# EAGLE schematic TESTOMATIC-v2_2 (EAGLE 9.7.0)

## Sheet 1 of 4: External Connections
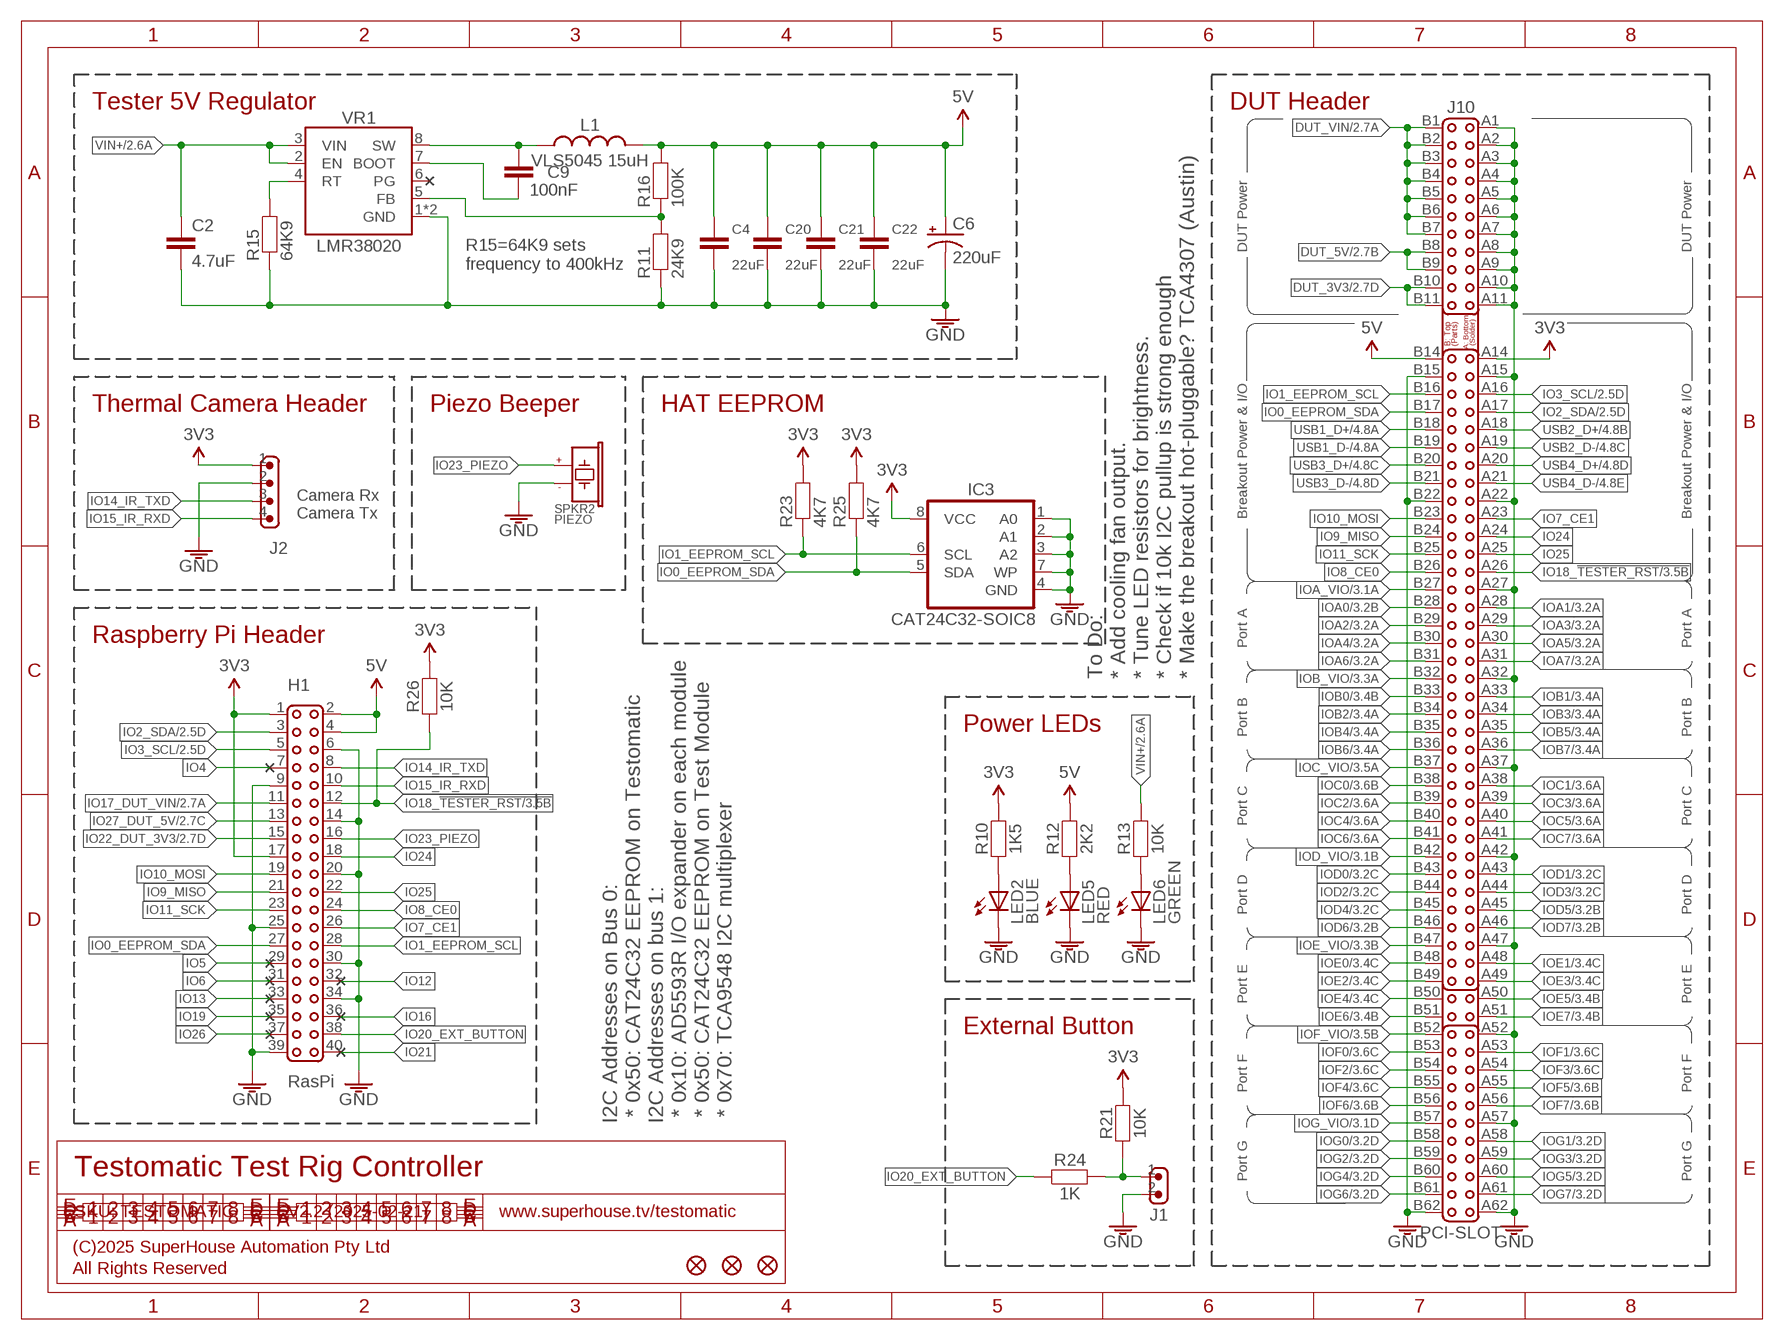
[diagram p0: schematic, sheet 1]

### Parts
C2  4.7uF  CAP1206  [C1206]
C4  22uF  CAP0805  [C0805]
C6  220uF  CAP_POLG  [PANASONIC_G]
C9  100nF  CAP0603  [C0603]
C20  22uF  CAP0805  [C0805]
C21  22uF  CAP0805  [C0805]
C22  22uF  CAP0805  [C0805]
FID1  FIDUCIAL1X2.5  [FIDUCIAL-1X2.5]
FID2  FIDUCIAL1X2.5  [FIDUCIAL-1X2.5]
FID3  FIDUCIAL1X2.5  [FIDUCIAL-1X2.5]
H1  RasPi  M02X20-PIN  [2X20-P]
IC3  CAT24C32-SOIC8  [SOIC8]
J1  M02-B2B-XH  [JST-B2B-XH-A]
J2  M04-B4B-XH  [JST-B4B-XH-A]
J10  PCI-SLOT  [PCI-SLOT]
L1  VLS5045 15uH  INDUCTOR-5045  [INDUCTOR-5045]
LED2  BLUE  LED0603  [LED-0603]
LED5  RED  LED0603  [LED-0603]
LED6  GREEN  LED0603  [LED-0603]
R10  1K5  RESISTOR0603  [R0603]
R11  24K9  RESISTOR0603  [R0603]
R12  2K2  RESISTOR0603  [R0603]
R13  10K  RESISTOR0603  [R0603]
R15  64K9  RESISTOR0603  [R0603]
R16  100K  RESISTOR0603  [R0603]
R21  10K  RESISTOR0603  [R0603]
R23  4K7  RESISTOR0603  [R0603]
R24  1K  RESISTOR0603  [R0603]
R25  4K7  RESISTOR0603  [R0603]
R26  10K  RESISTOR0603  [R0603]
SPKR2  PIEZO  PIEZOPOLARISED-SMT  [PIEZO-9.6X9.6-SMT]
VR1  LMR38020  LMR38010  [HSOIC8]

### Nets
3.3V: H1.1 H1.17 IC3.8(VCC) J2.1 J10.A14 R10.2 R21.2 R23.2 R25.2 R26.2 ; also sheet 2,3,4
5V: C4.1 C6.+ C20.1 C21.1 C22.1 H1.2 H1.4 J10.B14 L1.2 R12.2 R16.2 ; also sheet 2
DUT_3V3: J10.B10 J10.B11 ; also sheet 2
DUT_5V: J10.B8 J10.B9 ; also sheet 2
DUT_VIN: J10.B1 J10.B2 J10.B3 J10.B4 J10.B5 J10.B6 J10.B7 ; also sheet 2
GND: C2.2 C4.2 C6.- C20.2 C21.2 C22.2 H1.6 H1.9 H1.14 H1.20 H1.25 H1.30 H1.34 H1.39 IC3.1(A0) IC3.2(A1) IC3.3(A2) IC3.4(GND) IC3.7(WP) J1.2 J2.2 J10.A1 J10.A2 J10.A3 J10.A4 J10.A5 J10.A6 J10.A7 J10.A8 J10.A9 J10.A10 J10.A11 J10.A15 J10.A22 J10.A27 J10.A32 J10.A37 J10.A42 J10.A47 J10.A52 J10.A57 J10.A62 J10.B15 J10.B22 J10.B62 LED2.C LED5.C LED6.C R11.1 R15.1 SPKR2.2(-) VR1.1(GND) VR1.TGND(GND) ; also sheet 2,3,4
IO0_EEPROM_SDA: H1.27 IC3.5(SDA) J10.B17 R25.1
IO1_EEPROM_SCL: H1.28 IC3.6(SCL) J10.B16 R23.1
IO2_SDA: H1.3 J10.A17 ; also sheet 2,3
IO3_SCL: H1.5 J10.A16 ; also sheet 2,3
IO4: H1.7
IO5: H1.29
IO6: H1.31
IO7_CE1: H1.26 J10.A23
IO8_CE0: H1.24 J10.B26
IO9_MISO: H1.21 J10.B24
IO10_MOSI: H1.19 J10.B23
IO11_SCK: H1.23 J10.B25
IO12: H1.32
IO13: H1.33
IO14_IR_TXD: H1.8 J2.3
IO15_IR_RXD: H1.10 J2.4
IO16: H1.36
IO17_DUT_VIN: H1.11 ; also sheet 2
IO18_!TESTER_RST: H1.12 J10.A26 R26.1 ; also sheet 3
IO19: H1.35
IO20_EXT_BUTTON: H1.38 R24.1
IO21: H1.40
IO22_DUT_3V3: H1.15 ; also sheet 2
IO23_PIEZO: H1.16 SPKR2.1(+)
IO24: H1.18 J10.A24
IO25: H1.22 J10.A25
IO26: H1.37
IO27_DUT_5V: H1.13 ; also sheet 2
IOA0: J10.B28 ; also sheet 3
IOA1: J10.A28 ; also sheet 3
IOA2: J10.B29 ; also sheet 3
IOA3: J10.A29 ; also sheet 3
IOA4: J10.B30 ; also sheet 3
IOA5: J10.A30 ; also sheet 3
IOA6: J10.B31 ; also sheet 3
IOA7: J10.A31 ; also sheet 3
IOA_VIO: J10.B27 ; also sheet 3
IOB0: J10.B33 ; also sheet 3
IOB1: J10.A33 ; also sheet 3
IOB2: J10.B34 ; also sheet 3
IOB3: J10.A34 ; also sheet 3
IOB4: J10.B35 ; also sheet 3
IOB5: J10.A35 ; also sheet 3
IOB6: J10.B36 ; also sheet 3
IOB7: J10.A36 ; also sheet 3
IOB_VIO: J10.B32 ; also sheet 3
IOC0: J10.B38 ; also sheet 3
IOC1: J10.A38 ; also sheet 3
IOC2: J10.B39 ; also sheet 3
IOC3: J10.A39 ; also sheet 3
IOC4: J10.B40 ; also sheet 3
IOC5: J10.A40 ; also sheet 3
IOC6: J10.B41 ; also sheet 3
IOC7: J10.A41 ; also sheet 3
IOC_VIO: J10.B37 ; also sheet 3
IOD0: J10.B43 ; also sheet 3
IOD1: J10.A43 ; also sheet 3
IOD2: J10.B44 ; also sheet 3
IOD3: J10.A44 ; also sheet 3
IOD4: J10.B45 ; also sheet 3
IOD5: J10.A45 ; also sheet 3
IOD6: J10.B46 ; also sheet 3
IOD7: J10.A46 ; also sheet 3
IOD_VIO: J10.B42 ; also sheet 3
IOE0: J10.B48 ; also sheet 3
IOE1: J10.A48 ; also sheet 3
IOE2: J10.B49 ; also sheet 3
IOE3: J10.A49 ; also sheet 3
IOE4: J10.B50 ; also sheet 3
IOE5: J10.A50 ; also sheet 3
IOE6: J10.B51 ; also sheet 3
IOE7: J10.A51 ; also sheet 3
IOE_VIO: J10.B47 ; also sheet 3
IOF0: J10.B53 ; also sheet 3
IOF1: J10.A53 ; also sheet 3
IOF2: J10.B54 ; also sheet 3
IOF3: J10.A54 ; also sheet 3
IOF4: J10.B55 ; also sheet 3
IOF5: J10.A55 ; also sheet 3
IOF6: J10.B56 ; also sheet 3
IOF7: J10.A56 ; also sheet 3
IOF_VIO: J10.B52 ; also sheet 3
IOG0: J10.B58 ; also sheet 3
IOG1: J10.A58 ; also sheet 3
IOG2: J10.B59 ; also sheet 3
IOG3: J10.A59 ; also sheet 3
IOG4: J10.B60 ; also sheet 3
IOG5: J10.A60 ; also sheet 3
IOG6: J10.B61 ; also sheet 3
IOG7: J10.A61 ; also sheet 3
IOG_VIO: J10.B57 ; also sheet 3
N$2: LED2.A R10.1
N$3: C9.1 L1.1 VR1.8(SW)
N$4: LED5.A R12.1
N$5: LED6.A R13.1
N$9: J1.1 R21.1 R24.2
N$13: R15.2 VR1.4(RT)
N$18: R11.2 R16.1 VR1.5(FB)
N$19: C9.2 VR1.7(BOOT)
USB1_D+: J10.B18 ; also sheet 4
USB1_D-: J10.B19 ; also sheet 4
USB2_D+: J10.A18 ; also sheet 4
USB2_D-: J10.A19 ; also sheet 4
USB3_D+: J10.B20 ; also sheet 4
USB3_D-: J10.B21 ; also sheet 4
USB4_D+: J10.A20 ; also sheet 4
USB4_D-: J10.A21 ; also sheet 4
VIN+: C2.1 R13.2 VR1.2(EN) VR1.3(VIN) ; also sheet 2

### Notes on the sheet
- Tester 5V Regulator | DUT Header
- DUT Power | DUT Power
- R15=64K9 sets
  frequency to 400kHz
- Thermal Camera Header | Piezo Beeper | HAT EEPROM
- Camera Rx
- Camera Tx | Breakout Power & I/O | Breakout Power & I/O
- Raspberry Pi Header
- Port A | Port A
- To Do:
  * Add cooling fan output.
  * Tune LED resistors for brightness.
  * Check if 10k I2C pullup is strong enough
  * Make the breakout hot-pluggable? TCA4307 (Austin)
- Power LEDs
- Port B | Port B
- Port C | Port C
- Port D | Port D
- Port E | Port E
- External Button
- Port F | Port F
- I2C Addresses on Bus 0:
   * 0x50: CAT24C32 EEPROM on Testomatic
  I2C Addresses on bus 1:
   * 0x10: AD5593R I/O expander on each module
   * 0x50: CAT24C32 EEPROM on Test Module
   * 0x70: TCA9548 I2C multiplexer
- Testomatic Test Rig Controller
- Port G | Port G
- SKU: TESTOMATIC | V2.2 (2025-02-21) | www.superhouse.tv/testomatic
- (C)2025 SuperHouse Automation Pty Ltd
- All Rights Reserved

## Sheet 2 of 4: DUT Power
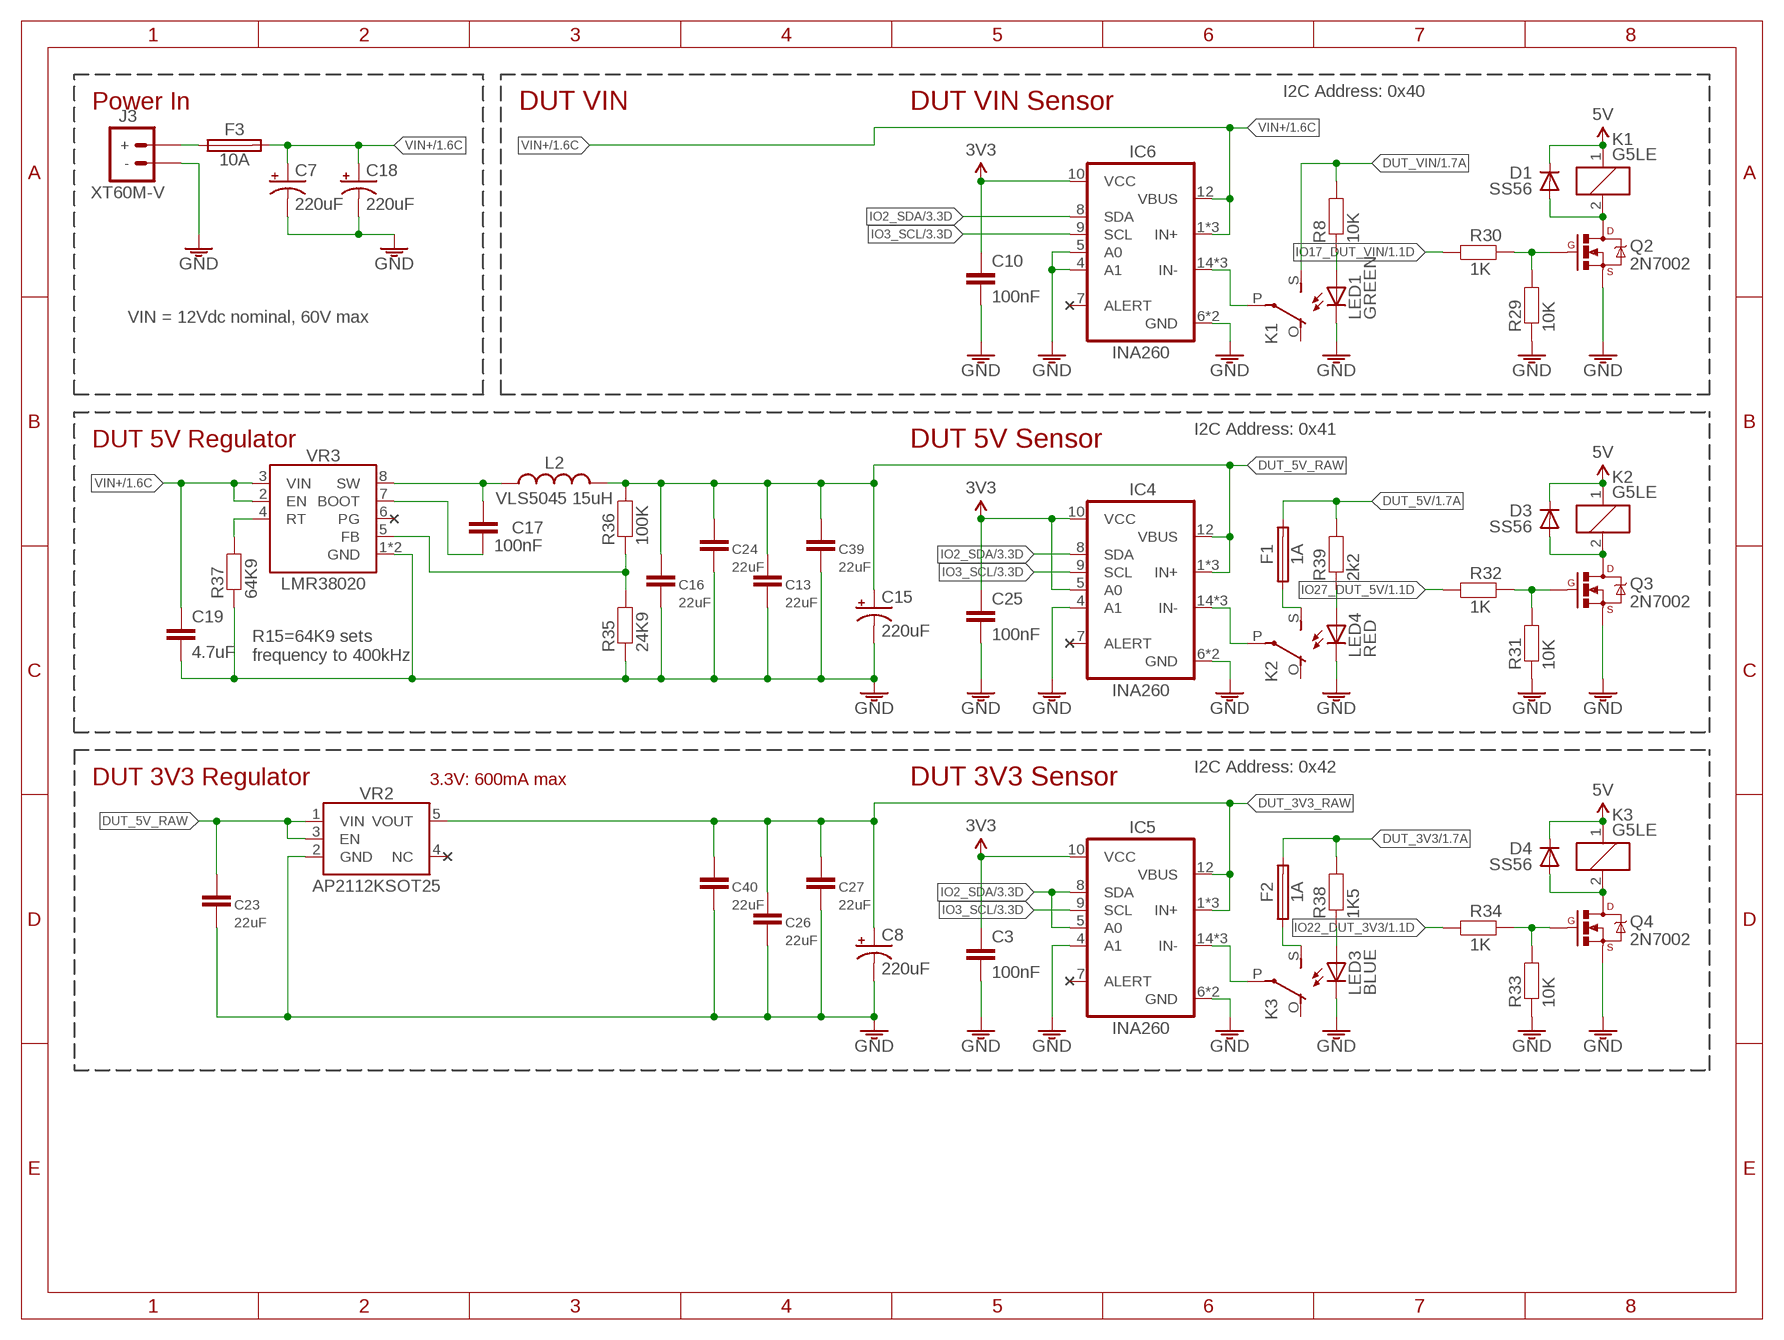
[diagram p1: schematic, sheet 2]

### Parts
C3  100nF  CAP0603  [C0603]
C7  220uF  CAP_POLG  [PANASONIC_G]
C8  220uF  CAP_POLG  [PANASONIC_G]
C10  100nF  CAP0603  [C0603]
C13  22uF  CAP0805  [C0805]
C15  220uF  CAP_POLG  [PANASONIC_G]
C16  22uF  CAP0805  [C0805]
C17  100nF  CAP0603  [C0603]
C18  220uF  CAP_POLG  [PANASONIC_G]
C19  4.7uF  CAP1206  [C1206]
C23  22uF  CAP0805  [C0805]
C24  22uF  CAP0805  [C0805]
C25  100nF  CAP0603  [C0603]
C26  22uF  CAP0805  [C0805]
C27  22uF  CAP0805  [C0805]
C39  22uF  CAP0805  [C0805]
C40  22uF  CAP0805  [C0805]
D1  SS56  DIODESMA  [SMA-DIODE]
D3  SS56  DIODESMA  [SMA-DIODE]
D4  SS56  DIODESMA  [SMA-DIODE]
F1  1A  PTC-1206  [1206]
F2  1A  PTC-1206  [1206]
F3  10A  FUSE-MCCQ  [MCCQ-122]
IC4  INA260  [TSSOP-16]
IC5  INA260  [TSSOP-16]
IC6  INA260  [TSSOP-16]
J3  XT60M-V  XTXX-60M-V  [XT60PW-M-V]
K1  G5LE  SPST  [G5LE]
K2  G5LE  SPDT-G5LE  [G5LE]
K3  G5LE  SPDT-G5LE  [G5LE]
L2  VLS5045 15uH  INDUCTOR-5045  [INDUCTOR-5045]
LED1  GREEN  LED0603  [LED-0603]
LED3  BLUE  LED0603  [LED-0603]
LED4  RED  LED0603  [LED-0603]
Q2  2N7002  MOSFET-NCHANNEL-233  [SOT23-3]
Q3  2N7002  MOSFET-NCHANNEL-233  [SOT23-3]
Q4  2N7002  MOSFET-NCHANNEL-233  [SOT23-3]
R8  10K  RESISTOR0603  [R0603]
R29  10K  RESISTOR0603  [R0603]
R30  1K  RESISTOR0603  [R0603]
R31  10K  RESISTOR0603  [R0603]
R32  1K  RESISTOR0603  [R0603]
R33  10K  RESISTOR0603  [R0603]
R34  1K  RESISTOR0603  [R0603]
R35  24K9  RESISTOR0603  [R0603]
R36  100K  RESISTOR0603  [R0603]
R37  64K9  RESISTOR0603  [R0603]
R38  1K5  RESISTOR0603  [R0603]
R39  2k2  RESISTOR0603  [R0603]
VR2  AP2112KSOT25  [SOT23-5]
VR3  LMR38020  LMR38010  [HSOIC8]

### Nets
3.3V: C3.1 C10.1 C25.1 IC4.5(A0) IC4.10(VCC) IC5.10(VCC) IC6.10(VCC) ; also sheet 1,3,4
5V: D1.C D3.C D4.C K1.1 K2.1 K3.1 ; also sheet 1
DUT_3V3: F2.2 R38.2 ; also sheet 1
DUT_3V3_RAW: C8.+ C26.1 C27.1 C40.1 IC5.1(IN+) IC5.2(IN+) IC5.3(IN+) IC5.12(VBUS) VR2.5(VOUT)
DUT_5V: F1.2 R39.2 ; also sheet 1
DUT_5V_RAW: C13.1 C15.+ C16.1 C23.1 C24.1 C39.1 IC4.1(IN+) IC4.2(IN+) IC4.3(IN+) IC4.12(VBUS) L2.2 R36.2 VR2.1(VIN) VR2.3(EN)
DUT_VIN: K1.S(2:NO) R8.2 ; also sheet 1
GND: C3.2 C7.- C8.- C10.2 C13.2 C15.- C16.2 C18.- C19.2 C23.2 C24.2 C25.2 C26.2 C27.2 C39.2 C40.2 IC4.4(A1) IC4.6(GND) IC4.11(GND) IC5.4(A1) IC5.6(GND) IC5.11(GND) IC6.4(A1) IC6.5(A0) IC6.6(GND) IC6.11(GND) J3.- LED1.C LED3.C LED4.C Q2.2(S) Q3.2(S) Q4.2(S) R29.1 R31.1 R33.1 R35.1 R37.1 VR2.2(GND) VR3.1(GND) VR3.TGND(GND) ; also sheet 1,3,4
IO2_SDA: IC4.8(SDA) IC5.5(A0) IC5.8(SDA) IC6.8(SDA) ; also sheet 1,3
IO3_SCL: IC4.9(SCL) IC5.9(SCL) IC6.9(SCL) ; also sheet 1,3
IO17_DUT_VIN: R30.1 ; also sheet 1
IO22_DUT_3V3: R34.1 ; also sheet 1
IO27_DUT_5V: R32.1 ; also sheet 1
N$8: F3.1 F3.2 J3.+
N$14: D4.A K3.2 Q4.3(D)
N$15: IC4.14(IN-) IC4.15(IN-) IC4.16(IN-) K2.P(2:COM)
N$16: IC6.14(IN-) IC6.15(IN-) IC6.16(IN-) K1.P(2:COM)
N$17: D1.A K1.2 Q2.3(D)
N$23: LED1.A R8.1
N$24: Q2.1(G) R29.2 R30.2
N$25: F2.1 K3.S(2:NO)
N$26: F1.1 K2.S(2:NO)
N$27: D3.A K2.2 Q3.3(D)
N$28: Q3.1(G) R31.2 R32.2
N$32: Q4.1(G) R33.2 R34.2
N$34: IC5.14(IN-) IC5.15(IN-) IC5.16(IN-) K3.P(2:COM)
N$39: C17.1 L2.1 VR3.8(SW)
N$40: R37.2 VR3.4(RT)
N$41: R35.2 R36.1 VR3.5(FB)
N$42: C17.2 VR3.7(BOOT)
N$43: LED4.A R39.1
N$44: LED3.A R38.1
VIN+: C7.+ C18.+ C19.1 F3.3 F3.4 IC6.1(IN+) IC6.2(IN+) IC6.3(IN+) IC6.12(VBUS) VR3.2(EN) VR3.3(VIN) ; also sheet 1
Unconnected: IC4.7(ALERT) IC5.7(ALERT) IC6.7(ALERT) K1.O(2:NC) K2.O(2:NC) K3.O(2:NC) VR2.4(NC)

### Notes on the sheet
- I2C Address: 0x40
- Power In | DUT VIN | DUT VIN Sensor
- VIN = 12Vdc nominal, 60V max
- I2C Address: 0x41
- DUT 5V Regulator | DUT 5V Sensor
- R15=64K9 sets
  frequency to 400kHz
- I2C Address: 0x42
- DUT 3V3 Regulator | 3.3V: 600mA max | DUT 3V3 Sensor

## Sheet 3 of 4: Digital & Analog I/O
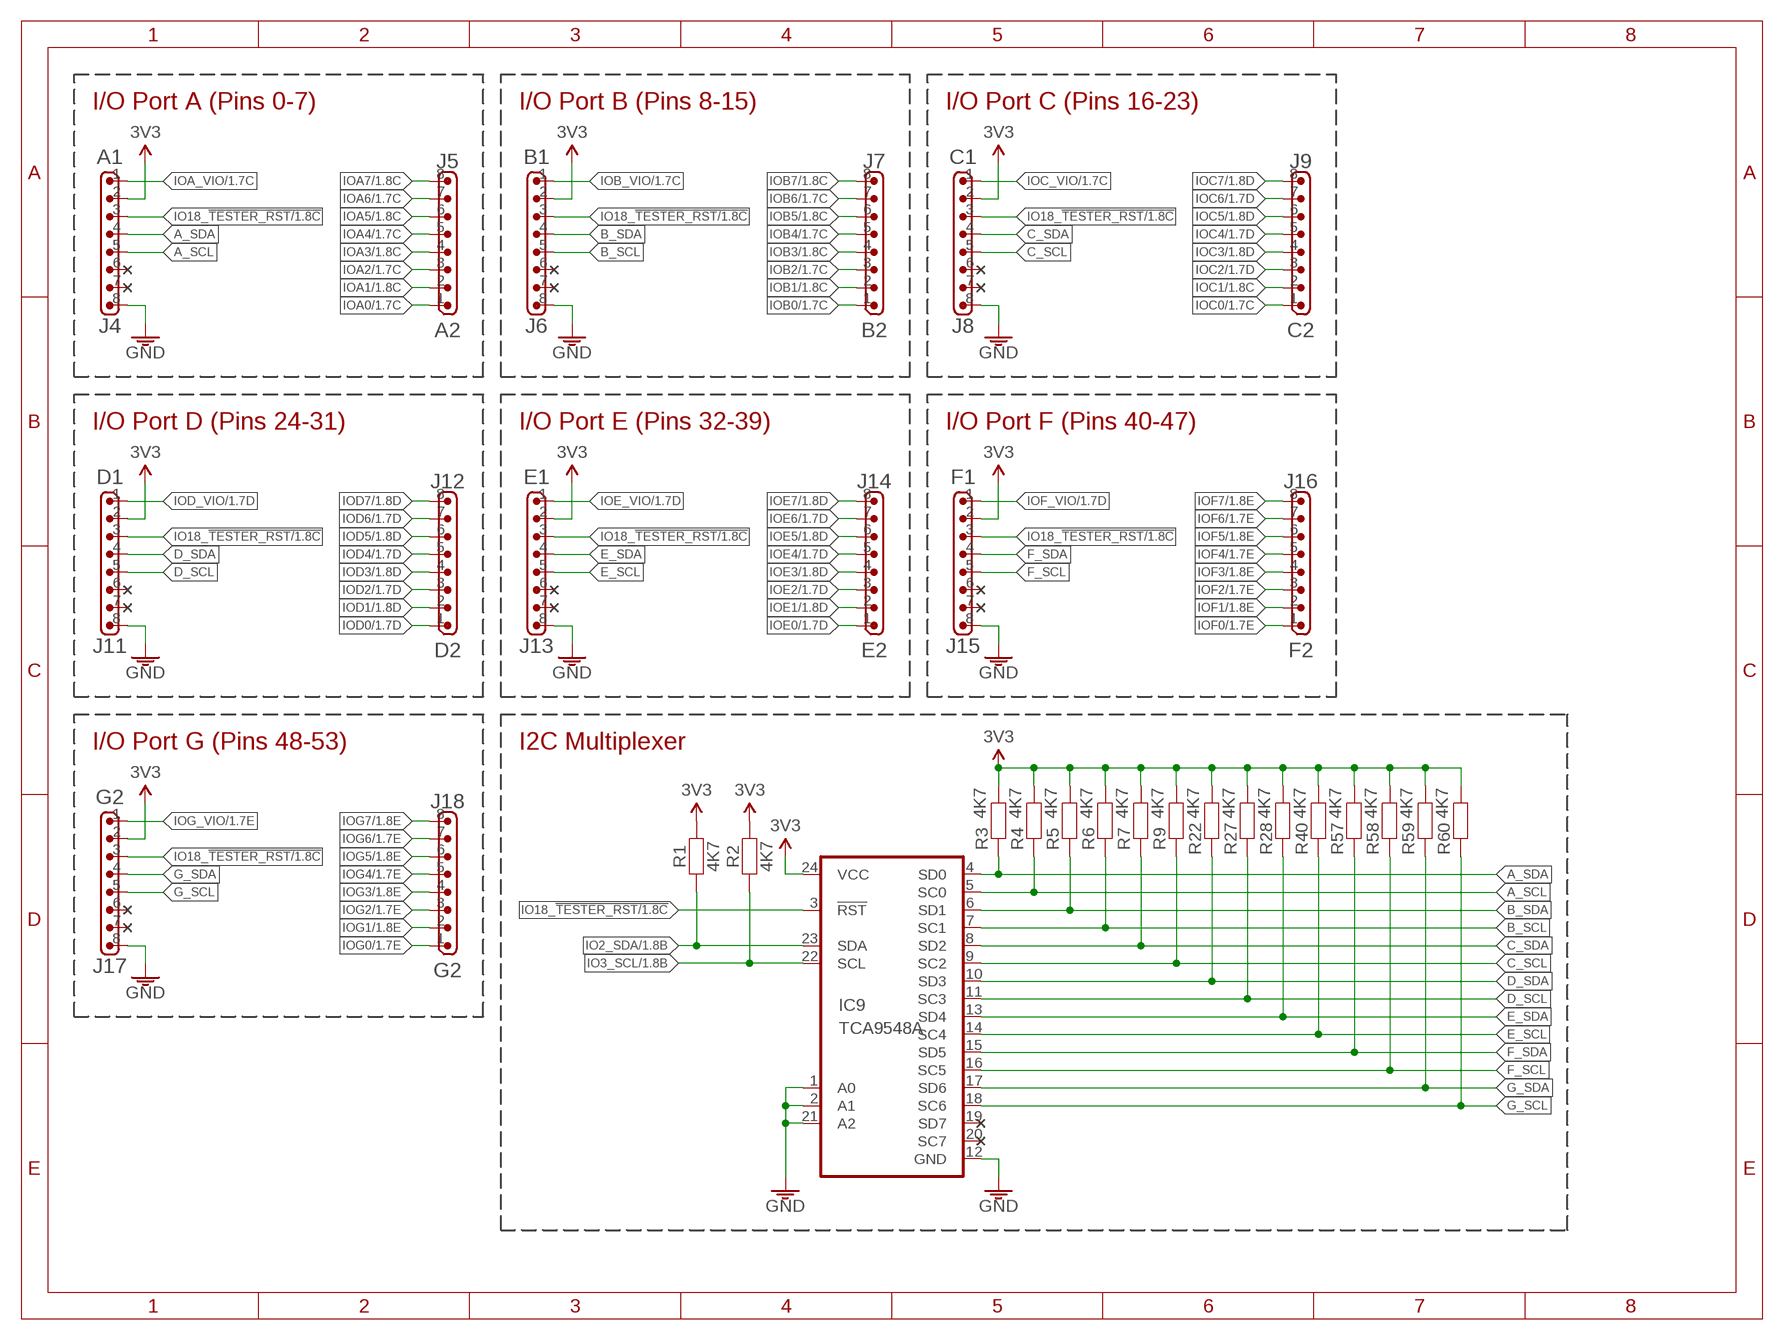
[diagram p2: schematic, sheet 3]

### Parts
IC9  TCA9548A  [TSSOP24]
J4  A1  M08-2.00-S  [1X8-2.00-S]
J5  A2  M08-2.00-S  [1X8-2.00-S]
J6  B1  M08-2.00-S  [1X8-2.00-S]
J7  B2  M08-2.00-S  [1X8-2.00-S]
J8  C1  M08-2.00-S  [1X8-2.00-S]
J9  C2  M08-2.00-S  [1X8-2.00-S]
J11  D1  M08-2.00-S  [1X8-2.00-S]
J12  D2  M08-2.00-S  [1X8-2.00-S]
J13  E1  M08-2.00-S  [1X8-2.00-S]
J14  E2  M08-2.00-S  [1X8-2.00-S]
J15  F1  M08-2.00-S  [1X8-2.00-S]
J16  F2  M08-2.00-S  [1X8-2.00-S]
J17  G2  M08-2.00-S  [1X8-2.00-S]
J18  G2  M08-2.00-S  [1X8-2.00-S]
R1  4K7  RESISTOR0603  [R0603]
R2  4K7  RESISTOR0603  [R0603]
R3  4K7  RESISTOR0603  [R0603]
R4  4K7  RESISTOR0603  [R0603]
R5  4K7  RESISTOR0603  [R0603]
R6  4K7  RESISTOR0603  [R0603]
R7  4K7  RESISTOR0603  [R0603]
R9  4K7  RESISTOR0603  [R0603]
R22  4K7  RESISTOR0603  [R0603]
R27  4K7  RESISTOR0603  [R0603]
R28  4K7  RESISTOR0603  [R0603]
R40  4K7  RESISTOR0603  [R0603]
R57  4K7  RESISTOR0603  [R0603]
R58  4K7  RESISTOR0603  [R0603]
R59  4K7  RESISTOR0603  [R0603]
R60  4K7  RESISTOR0603  [R0603]

### Nets
3.3V: IC9.24(VCC) J4.2 J6.2 J8.2 J11.2 J13.2 J15.2 J17.2 R1.2 R2.2 R3.2 R4.2 R5.2 R6.2 R7.2 R9.2 R22.2 R27.2 R28.2 R40.2 R57.2 R58.2 R59.2 R60.2 ; also sheet 1,2,4
A_SCL: IC9.5(SC0) J4.5 R4.1
A_SDA: IC9.4(SD0) J4.4 R3.1
B_SCL: IC9.7(SC1) J6.5 R6.1
B_SDA: IC9.6(SD1) J6.4 R5.1
C_SCL: IC9.9(SC2) J8.5 R9.1
C_SDA: IC9.8(SD2) J8.4 R7.1
D_SCL: IC9.11(SC3) J11.5 R27.1
D_SDA: IC9.10(SD3) J11.4 R22.1
E_SCL: IC9.14(SC4) J13.5 R40.1
E_SDA: IC9.13(SD4) J13.4 R28.1
F_SCL: IC9.16(SC5) J15.5 R58.1
F_SDA: IC9.15(SD5) J15.4 R57.1
G_SCL: IC9.18(SC6) J17.5 R60.1
G_SDA: IC9.17(SD6) J17.4 R59.1
GND: IC9.1(A0) IC9.2(A1) IC9.12(GND) IC9.21(A2) J4.8 J6.8 J8.8 J11.8 J13.8 J15.8 J17.8 ; also sheet 1,2,4
IO2_SDA: IC9.23(SDA) R1.1 ; also sheet 1,2
IO3_SCL: IC9.22(SCL) R2.1 ; also sheet 1,2
IO18_!TESTER_RST: IC9.3(!RST) J4.3 J6.3 J8.3 J11.3 J13.3 J15.3 J17.3 ; also sheet 1
IOA0: J5.1 ; also sheet 1
IOA1: J5.2 ; also sheet 1
IOA2: J5.3 ; also sheet 1
IOA3: J5.4 ; also sheet 1
IOA4: J5.5 ; also sheet 1
IOA5: J5.6 ; also sheet 1
IOA6: J5.7 ; also sheet 1
IOA7: J5.8 ; also sheet 1
IOA_VIO: J4.1 ; also sheet 1
IOB0: J7.1 ; also sheet 1
IOB1: J7.2 ; also sheet 1
IOB2: J7.3 ; also sheet 1
IOB3: J7.4 ; also sheet 1
IOB4: J7.5 ; also sheet 1
IOB5: J7.6 ; also sheet 1
IOB6: J7.7 ; also sheet 1
IOB7: J7.8 ; also sheet 1
IOB_VIO: J6.1 ; also sheet 1
IOC0: J9.1 ; also sheet 1
IOC1: J9.2 ; also sheet 1
IOC2: J9.3 ; also sheet 1
IOC3: J9.4 ; also sheet 1
IOC4: J9.5 ; also sheet 1
IOC5: J9.6 ; also sheet 1
IOC6: J9.7 ; also sheet 1
IOC7: J9.8 ; also sheet 1
IOC_VIO: J8.1 ; also sheet 1
IOD0: J12.1 ; also sheet 1
IOD1: J12.2 ; also sheet 1
IOD2: J12.3 ; also sheet 1
IOD3: J12.4 ; also sheet 1
IOD4: J12.5 ; also sheet 1
IOD5: J12.6 ; also sheet 1
IOD6: J12.7 ; also sheet 1
IOD7: J12.8 ; also sheet 1
IOD_VIO: J11.1 ; also sheet 1
IOE0: J14.1 ; also sheet 1
IOE1: J14.2 ; also sheet 1
IOE2: J14.3 ; also sheet 1
IOE3: J14.4 ; also sheet 1
IOE4: J14.5 ; also sheet 1
IOE5: J14.6 ; also sheet 1
IOE6: J14.7 ; also sheet 1
IOE7: J14.8 ; also sheet 1
IOE_VIO: J13.1 ; also sheet 1
IOF0: J16.1 ; also sheet 1
IOF1: J16.2 ; also sheet 1
IOF2: J16.3 ; also sheet 1
IOF3: J16.4 ; also sheet 1
IOF4: J16.5 ; also sheet 1
IOF5: J16.6 ; also sheet 1
IOF6: J16.7 ; also sheet 1
IOF7: J16.8 ; also sheet 1
IOF_VIO: J15.1 ; also sheet 1
IOG0: J18.1 ; also sheet 1
IOG1: J18.2 ; also sheet 1
IOG2: J18.3 ; also sheet 1
IOG3: J18.4 ; also sheet 1
IOG4: J18.5 ; also sheet 1
IOG5: J18.6 ; also sheet 1
IOG6: J18.7 ; also sheet 1
IOG7: J18.8 ; also sheet 1
IOG_VIO: J17.1 ; also sheet 1
Unconnected: IC9.19(SD7) IC9.20(SC7) J4.6 J4.7 J6.6 J6.7 J8.6 J8.7 J11.6 J11.7 J13.6 J13.7 J15.6 J15.7 J17.6 J17.7

### Notes on the sheet
- I/O Port A (Pins 0-7) | I/O Port B (Pins 8-15) | I/O Port C (Pins 16-23)
- I/O Port D (Pins 24-31) | I/O Port E (Pins 32-39) | I/O Port F (Pins 40-47)
- I/O Port G (Pins 48-53) | I2C Multiplexer

## Sheet 4 of 4: USB Connections
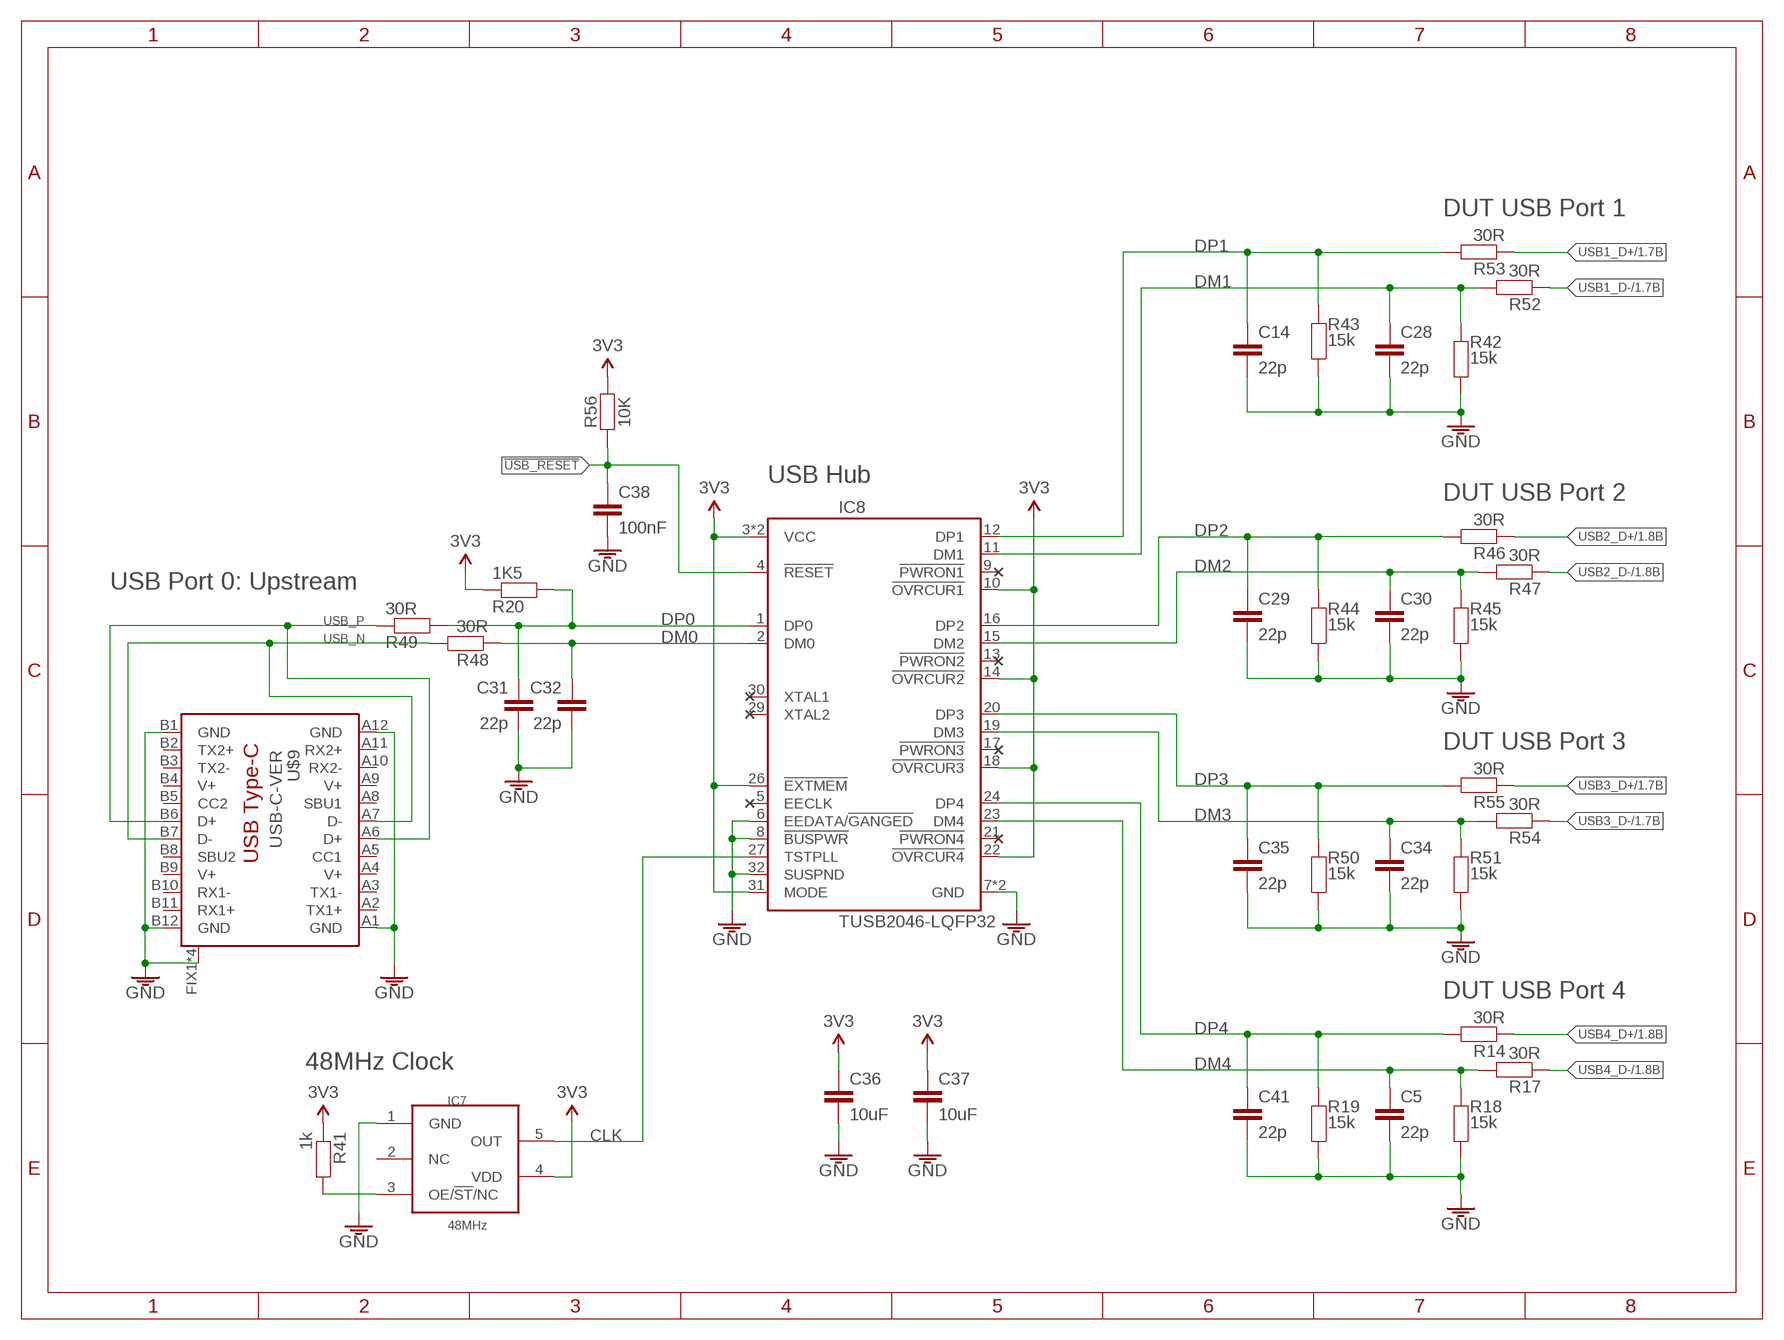
[diagram p3: schematic, sheet 4]

### Parts
C5  22p  CAP0603  [C0603]
C14  22p  CAP0603  [C0603]
C28  22p  CAP0603  [C0603]
C29  22p  CAP0603  [C0603]
C30  22p  CAP0603  [C0603]
C31  22p  CAP0603  [C0603]
C32  22p  CAP0603  [C0603]
C34  22p  CAP0603  [C0603]
C35  22p  CAP0603  [C0603]
C36  10uF  CAP0805  [C0805]
C37  10uF  CAP0805  [C0805]
C38  100nF  CAP0603  [C0603]
C41  22p  CAP0603  [C0603]
IC7  48MHz  SIT2001BSOT-23-5  [SOT-23-5]
IC8  TUSB2046-LQFP32  [LQFP32]
R14  30R  RESISTOR0603  [R0603]
R17  30R  RESISTOR0603  [R0603]
R18  15k  RESISTOR0603  [R0603]
R19  15k  RESISTOR0603  [R0603]
R20  1K5  RESISTOR0603  [R0603]
R41  1k  RESISTOR0603  [R0603]
R42  15k  RESISTOR0603  [R0603]
R43  15k  RESISTOR0603  [R0603]
R44  15k  RESISTOR0603  [R0603]
R45  15k  RESISTOR0603  [R0603]
R46  30R  RESISTOR0603  [R0603]
R47  30R  RESISTOR0603  [R0603]
R48  30R  RESISTOR0603  [R0603]
R49  30R  RESISTOR0603  [R0603]
R50  15k  RESISTOR0603  [R0603]
R51  15k  RESISTOR0603  [R0603]
R52  30R  RESISTOR0603  [R0603]
R53  30R  RESISTOR0603  [R0603]
R54  30R  RESISTOR0603  [R0603]
R55  30R  RESISTOR0603  [R0603]
R56  10K  RESISTOR0603  [R0603]
U$9  USB-C-VER  [USB-C-VERT]

### Nets
3.3V: C36.1 C37.1 IC7.4(VDD) IC8.3(VCC) IC8.10(!OVRCUR1) IC8.14(!OVRCUR2) IC8.18(!OVRCUR3) IC8.22(!OVRCUR4) IC8.25(VCC) IC8.26(!EXTMEM) IC8.31(MODE) R20.1 R41.1 R56.2 ; also sheet 1,2,3
!USB_RESET: C38.1 IC8.4(!RESET) R56.1
CLK: IC7.5(OUT) IC8.27(TSTPLL)
DM0: C32.1 IC8.2(DM0) R48.2
DM1: C28.1 IC8.11(DM1) R42.1 R52.2
DM2: C30.1 IC8.15(DM2) R45.1 R47.2
DM3: C34.1 IC8.19(DM3) R51.1 R54.2
DM4: C5.1 IC8.23(DM4) R17.2 R18.1
DP0: C31.1 IC8.1(DP0) R20.2 R49.2
DP1: C14.1 IC8.12(DP1) R43.1 R53.2
DP2: C29.1 IC8.16(DP2) R44.1 R46.2
DP3: C35.1 IC8.20(DP3) R50.1 R55.2
DP4: C41.1 IC8.24(DP4) R14.2 R19.1
GND: C5.2 C14.2 C28.2 C29.2 C30.2 C31.2 C32.2 C34.2 C35.2 C36.2 C37.2 C38.2 C41.2 IC7.1(GND) IC8.6(EEDATA/!GANGED) IC8.7(GND) IC8.8(!BUSPWR) IC8.28(GND) IC8.32(SUSPND) R18.2 R19.2 R42.2 R43.2 R44.2 R45.2 R50.2 R51.2 U$9.A1(GND) U$9.A12(GND) U$9.B1(GND) U$9.B12(GND) U$9.FIX1(CASE) U$9.FIX2(CASE) U$9.FIX3(CASE) U$9.FIX4(CASE) ; also sheet 1,2,3
N$46: IC7.3(OE/!ST!/NC) R41.2
USB1_D+: R53.1 ; also sheet 1
USB1_D-: R52.1 ; also sheet 1
USB2_D+: R46.1 ; also sheet 1
USB2_D-: R47.1 ; also sheet 1
USB3_D+: R55.1 ; also sheet 1
USB3_D-: R54.1 ; also sheet 1
USB4_D+: R14.1 ; also sheet 1
USB4_D-: R17.1 ; also sheet 1
USB_N: R48.1 U$9.A7(D-) U$9.B7(D-)
USB_P: R49.1 U$9.A6(D+) U$9.B6(D+)
Unconnected: IC7.2(NC) IC8.5(EECLK) IC8.9(!PWRON1) IC8.13(!PWRON2) IC8.17(!PWRON3) IC8.21(!PWRON4) IC8.29(XTAL2) IC8.30(XTAL1) U$9.A2(TX1+) U$9.A3(TX1-) U$9.A5(CC1) U$9.A8(SBU1) U$9.A10(RX2-) U$9.A11(RX2+) U$9.B2(TX2+) U$9.B3(TX2-) U$9.B5(CC2) U$9.B8(SBU2) U$9.B10(RX1-) U$9.B11(RX1+)

### Notes on the sheet
- DUT USB Port 1
- USB Hub
- DUT USB Port 2
- USB Port 0: Upstream
- DUT USB Port 3
- DUT USB Port 4
- 48MHz Clock

## Power pins joined to a net without a drawn wire
PG: VR1.6(PG) VR3.6(PG)
V+: U$9.A4(V+) U$9.A9(V+) U$9.B4(V+) U$9.B9(V+)

## Library data of the parts
C2-C5 C9 C10 C13 C14 C16 C17 C19-C30 C34-C37 C39-C41 = SuperHouse-Capacitors:CAP: Capacitor Standard ceramic capacitor
C6-C8 C15 C18 = SuperHouse-Capacitors:CAP_POL: Capacitor Polarized These are standard SMD and PTH capacitors. Normally 10uF, 47uF, and 100uF in electrolytic and tantalum varieties. Always verify the external diameter of the through hole cap, it varies with capacity, voltage, and manufacturer. The EIA devices should be standard.
C31 C32 C38 = SuperHouse-DiscreteSemi:CAP: Capacitor Standard ceramic capacitor
D1 D3 D4 = SuperHouse-Diodes:DIODE: Diode Standard reverse protection diodes and small signal diodes. SMA package can handle up to about 1A. SOD-323 can handle about 200mA.
F1 F2 = SuperHouse-Fuses:PTC: Resettable polyfuses
F3 = SuperHouse-Fuses:FUSE: Fuse
FID1-FID3 = SuperHouse-Symbols:FIDUCIAL: Fiducial Alignment Points Various fiducial points for machine vision alignment.
H1 = SuperHouse-Connectors:M02X20: M40 header in 2x20 format
IC3 = SuperHouse-ICs:CAT24C32
IC4-IC6 = SuperHouse-Sensors:INA260: INA260 current / voltage sensor
IC7 = my library:SIT2001B
IC8 = SuperHouse-ICs:TUSB2046
IC9 = SuperHouse-ICs:TCA9548A
J1 = SuperHouse-Connectors:M02: 2-way header Standard 1x2 header, and screw terminal variations
J2 = SuperHouse-Connectors:M04: 4-way header Standard 1x4 header, and screw terminal variations
J3 = SuperHouse-Connectors:XTXX: XT30/60/90 connector
J4-J9 J11-J18 = SuperHouse-Connectors:M08: 8-way header Standard 1x8 header, and screw terminal variations
J10 = SuperHouse-Connectors:PCI
K1 = SuperHouse-Relays:SPST: SPST relay in various packages: Omron G5LE; OC_FARNELL: unknown; OC_NEWARK: unknown
K2 K3 = SuperHouse-Relays:SPDT: SPST relay in various packages: Omron G5LE; OC_FARNELL: unknown; OC_NEWARK: unknown
L1 L2 = SuperHouse-Inductors:INDUCTOR: INDUCTOR, American symbol
LED1-LED6 = SuperHouse-LEDs:LED: LEDs in various sizes including 5mm and 3mm PTH, and 0402, 0603, 0805, etc SMT
Q2-Q4 = SuperHouse-Transistors:MOSFET-NCHANNEL: N-channel MOSFET
R1-R13 R15 R16 R21-R40 R56-R60 = SuperHouse-Resistors:RESISTOR: Resistors in both surface-mount and through-hole versions.
R14 R17-R20 R41-R55 = SuperHouse-DiscreteSemi:RESISTOR: Resistor Standard resistors.
SPKR2 = SuperHouse-Audio:PIEZOPOLARISED
U$9 = SuperHouse-Connectors:USB-C
VR1 VR3 = SuperHouse-Regulators:LMR38010
VR2 = SuperHouse-Regulators:AP2112K: AP2112K LDO linear voltage regulator

## Net classes
0 Default: width 0.203 mm
1 VCC: width 0.305 mm